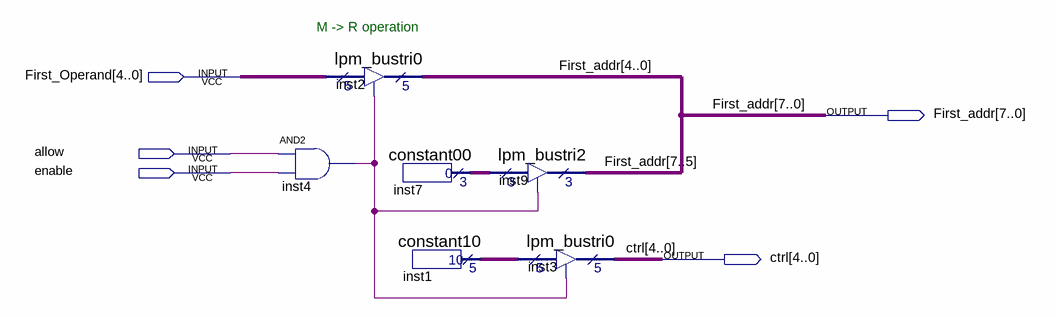
[diagram p0: schematic sheet]
// Quartus schematic M-R_Operation.bdf as structural Verilog: 6 symbols, 5 pins
module \M-R_Operation  (
  input  [4:0] First_Operand,
  input  allow,
  input  enable,
  output [7:0] First_addr,
  output [4:0] ctrl
);

  wire inst4_out;
  wire [2:0] inst7_result;
  wire [4:0] inst1_result;

  lpm_bustri0 inst2 (.enabledt(inst4_out), .data(First_Operand), .tridata(First_addr[4:0]));
  and inst4 (inst4_out, allow, enable);
  constant00 inst7 (.result(inst7_result));
  constant10 inst1 (.result(inst1_result));
  lpm_bustri2 inst9 (.enabledt(inst4_out), .data(inst7_result), .tridata(First_addr[7:5]));
  lpm_bustri0 inst3 (.enabledt(inst4_out), .data(inst1_result), .tridata(ctrl));

  // Notes on the sheet:
  //   M -> R operation
endmodule
